# Altium schematic sheet Deej.SchDoc
size A4
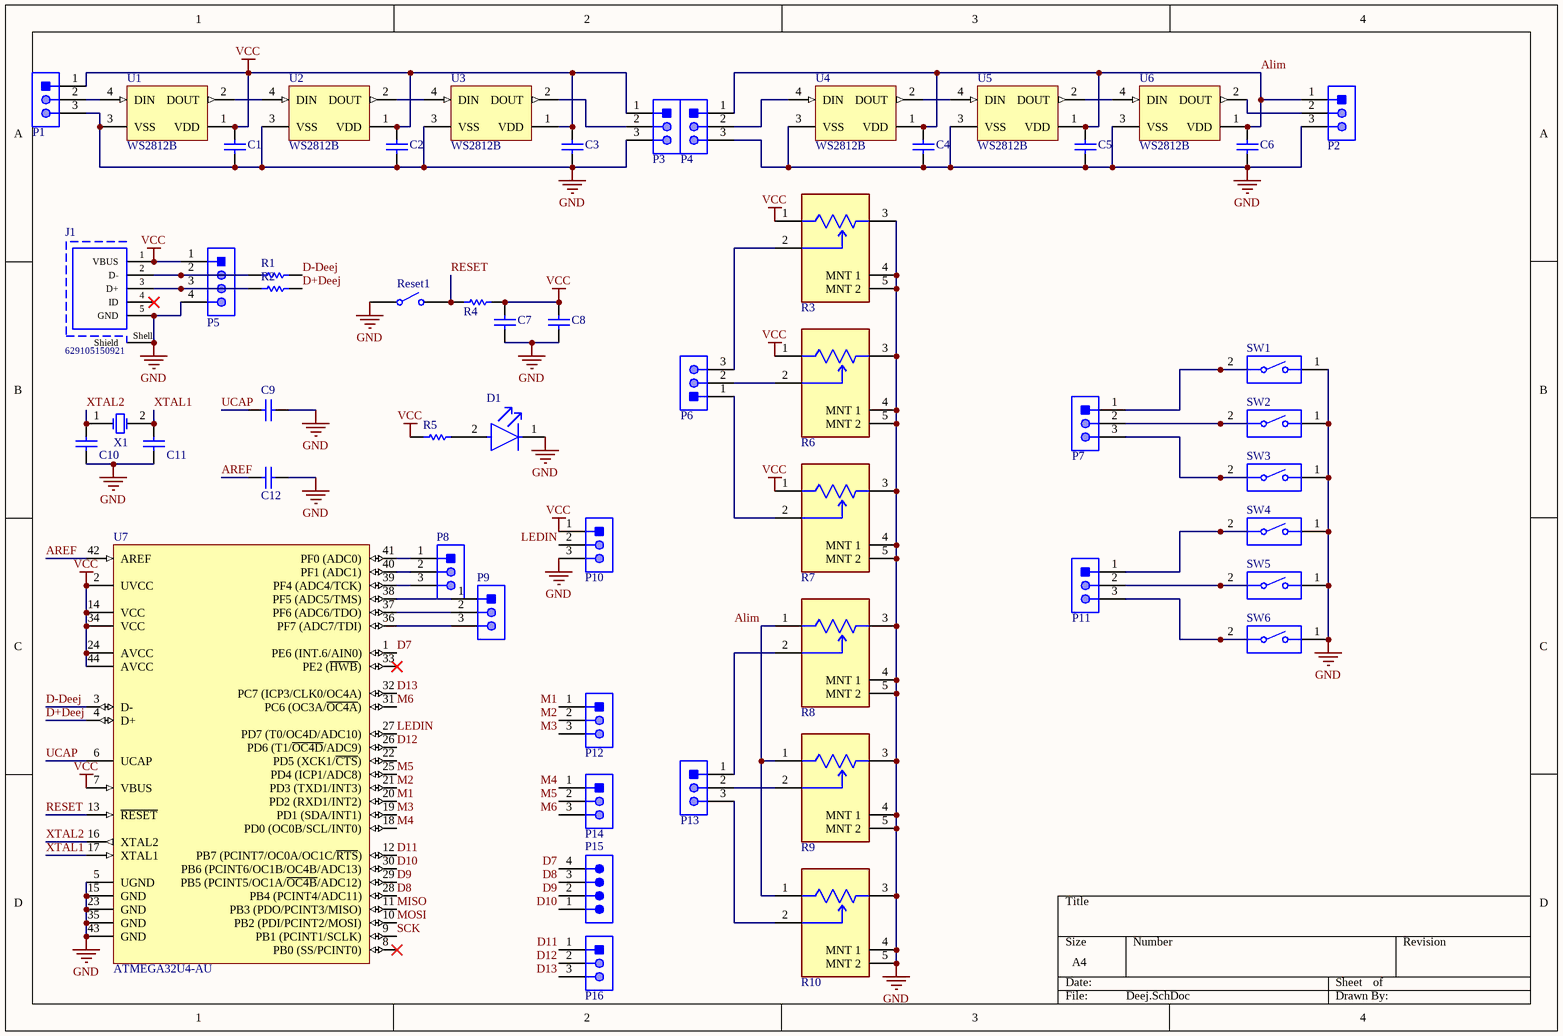
[diagram p0: Deej.SchDoc]

## Parts
C1  GRM31C5C1E104JA01L  [CAPC3216X180X55LL20T25]  (value not drawn)
C2  GRM31C5C1E104JA01L  [CAPC3216X180X55LL20T25]  (value not drawn)
C3  GRM31C5C1E104JA01L  [CAPC3216X180X55LL20T25]  (value not drawn)
C4  GRM31C5C1E104JA01L  [CAPC3216X180X55LL20T25]  (value not drawn)
C5  GRM31C5C1E104JA01L  [CAPC3216X180X55LL20T25]  (value not drawn)
C6  GRM31C5C1E104JA01L  [CAPC3216X180X55LL20T25]  (value not drawn)
C7  GRM31C5C1E104JA01L  [CAPC3216X180X55LL20T25]  (value not drawn)
C8  GRM31C5C1E104JA01L  [CAPC3216X180X55LL20T25]  (value not drawn)
C9  C1206C105K3RACTU  [CAPC3216X180X50ML20T25]  (value not drawn)
C10  CAP 22pF 50V 1206(3216)  [CAPC1206(3216)100_N]  (value not drawn)
C11  CAP 22 pF 50V 1206(3216)  [CAPC1206(3216)100_N]  (value not drawn)
C12  GRM31C5C1E104JA01L  [CAPC3216X180X55LL20T25]  (value not drawn)
D1  APTD3216CGCK  [FP-APTD3216CGCK-MFG]  (value not drawn)
J1  629105150921  [629105150921]
P1  22-28-4033  [MOLX-22-28-4033_V]  (value not drawn)
P2  22-28-4033  [MOLX-22-28-4033_V]  (value not drawn)
P3  22-28-4033  [MOLX-22-28-4033_V]  (value not drawn)
P4  22-28-4033  [MOLX-22-28-4033_V]  (value not drawn)
P5  61300411121  [61300411121]  (value not drawn)
P6  22-28-4033  [MOLX-22-28-4033_V]  (value not drawn)
P7  22-28-4033  [MOLX-22-28-4033_V]  (value not drawn)
P8  22-28-4033  [MOLX-22-28-4033_V]  (value not drawn)
P9  22-28-4033  [MOLX-22-28-4033_V]  (value not drawn)
P10  22-28-4033  [MOLX-22-28-4033_V]  (value not drawn)
P11  22-28-4033  [MOLX-22-28-4033_V]  (value not drawn)
P12  22-28-4033  [MOLX-22-28-4033_V]  (value not drawn)
P13  22-28-4033  [MOLX-22-28-4033_V]  (value not drawn)
P14  22-28-4033  [MOLX-22-28-4033_V]  (value not drawn)
P15  TSW-104-08-T-S  [SMTC-TSW-104-08-X-S]  (value not drawn)
P16  22-28-4033  [MOLX-22-28-4033_V]  (value not drawn)
R1  ERJ-8GEYJ220V  [RESC3216X70X50NL05T20]  (value not drawn)
R2  ERJ-8GEYJ220V  [RESC3216X70X50NL05T20]  (value not drawn)
R3  PTV09A-4020U-B103  [FP-PTV09A-4-MFG]  (value not drawn)
R4  ERJ-P08J103V  [RESC3216X70X50LL05T20]  (value not drawn)
R5  ERJ8ENF2203V  [RESC3216X70X50LL05T20]  (value not drawn)
R6  PTV09A-4020U-B103  [FP-PTV09A-4-MFG]  (value not drawn)
R7  PTV09A-4020U-B103  [FP-PTV09A-4-MFG]  (value not drawn)
R8  PTV09A-4020U-B103  [FP-PTV09A-4-MFG]  (value not drawn)
R9  PTV09A-4020U-B103  [FP-PTV09A-4-MFG]  (value not drawn)
R10  PTV09A-4020U-B103  [FP-PTV09A-4-MFG]  (value not drawn)
Reset1  434121025816  [434121025816]  (value not drawn)
SW1  MX1A-11NW  [CHRY-MX1A-11NW_V]  (value not drawn)
SW2  MX1A-11NW  [CHRY-MX1A-11NW_V]  (value not drawn)
SW3  MX1A-11NW  [CHRY-MX1A-11NW_V]  (value not drawn)
SW4  MX1A-11NW  [CHRY-MX1A-11NW_V]  (value not drawn)
SW5  MX1A-11NW  [CHRY-MX1A-11NW_V]  (value not drawn)
SW6  MX1A-11NW  [CHRY-MX1A-11NW_V]  (value not drawn)
U1  WS2812B  [ADAI-WS2812B_V]
U2  WS2812B  [ADAI-WS2812B_V]
U3  WS2812B  [ADAI-WS2812B_V]
U4  WS2812B  [ADAI-WS2812B_V]
U5  WS2812B  [ADAI-WS2812B_V]
U6  WS2812B  [ADAI-WS2812B_V]
U7  ATMEGA32U4-AU  [ATML-44ML_M]
X1  9C-3.6864MBBK-T  [TXC-9C-2_V]  (value not drawn)

## Nets
GND: C1.1 C2.1 C3.1 C4.1 C5.1 C6.1 C7.1 C8.1 C9.2 C10.1 C11.1 C12.1 D1.1(C) J1.5(GND) J1.Shell(Shield) P1.3 P2.3 P3.3 P4.3 P5.4 P10.3 R3.3 R3.4(MNT_1) R3.5(MNT_2) R6.3 R6.4(MNT_1) R6.5(MNT_2) R7.3 R7.4(MNT_1) R7.5(MNT_2) R8.3 R8.4(MNT_1) R8.5(MNT_2) R9.3 R9.4(MNT_1) R9.5(MNT_2) R10.3 R10.4(MNT_1) R10.5(MNT_2) Reset1.1 SW1.1 SW2.1 SW3.1 SW4.1 SW5.1 SW6.1 U1.3(VSS) U2.3(VSS) U3.3(VSS) U4.3(VSS) U5.3(VSS) U6.3(VSS) U7.5(UGND) U7.15(GND) U7.23(GND) U7.35(GND) U7.43(GND)
VCC: C1.2 C2.2 C3.2 C7.2 C8.2 J1.1(VBUS) P1.1 P3.1 P5.1 P10.1 R3.1 R4.1 R5.1 R6.1 R7.1 U1.1(VDD) U2.1(VDD) U3.1(VDD) U7.2(UVCC) U7.7(VBUS) U7.14(VCC) U7.24(AVCC) U7.34(VCC) U7.44(AVCC)
Alim: C4.2 C5.2 C6.2 P2.1 P4.1 R8.1 R9.1 R10.1 U4.1(VDD) U5.1(VDD) U6.1(VDD)
AREF: C12.2 U7.42(AREF)
D7: P15.4 U7.1(PE6_(INT.6/AIN0))
D8: P15.3 U7.28(PB4_(PCINT4/ADC11))
D9: P15.2 U7.29(PB5_(PCINT5/OC1A/~{OC4B}/ADC12))
D10: P15.1 U7.30(PB6_(PCINT6/OC1B/OC4B/ADC13))
D11: P16.1 U7.12(PB7_(PCINT7/OC0A/OC1C/~{RTS}))
D12: P16.2 U7.26(PD6_(T1/~{OC4D}/ADC9))
D13: P16.3 U7.32(PC7_(ICP3/CLK0/OC4A))
D+Deej: R2.2 U7.4(D+)
D-Deej: R1.2 U7.3(D-)
LEDIN: P10.2 U7.27(PD7_(T0/OC4D/ADC10))
M1: P12.1 U7.20(PD2_(RXD1/INT2))
M2: P12.2 U7.21(PD3_(TXD1/INT3))
M3: P12.3 U7.19(PD1_(SDA/INT1))
M4: P14.1 U7.18(PD0_(OC0B/SCL/INT0))
M5: P14.2 U7.25(PD4_(ICP1/ADC8))
M6: P14.3 U7.31(PC6_(OC3A/~{OC4A}))
MISO: U7.11(PB3_(PDO/PCINT3/MISO))
MOSI: U7.10(PB2_(PDI/PCINT2/MOSI))
RESET: R4.2 Reset1.2 U7.13(~{RESET})
SCK: U7.9(PB1_(PCINT1/SCLK))
UCAP: C9.1 U7.6(UCAP)
XTAL1: C11.2 U7.17(XTAL1) X1.2(X2)
XTAL2: C10.2 U7.16(XTAL2) X1.1(X1)
NetD1_2: D1.2(A) R5.2
NetJ1_2: J1.2(D-) P5.2 R1.1
NetJ1_3: J1.3(D+) P5.3 R2.1
NetP1_2: P1.2 U1.4(DIN)
NetP2_2: P2.2 U6.2(DOUT)
NetP3_2: P3.2 U3.2(DOUT)
NetP4_2: P4.2 U4.4(DIN)
NetP6_1: P6.1 R7.2
NetP6_2: P6.2 R6.2
NetP6_3: P6.3 R3.2
NetP7_1: P7.1 SW1.2
NetP7_2: P7.2 SW2.2
NetP7_3: P7.3 SW3.2
NetP8_1: P8.1 U7.41(PF0_(ADC0))
NetP8_2: P8.2 U7.40(PF1_(ADC1))
NetP8_3: P8.3 U7.39(PF4_(ADC4/TCK))
NetP9_1: P9.1 U7.38(PF5_(ADC5/TMS))
NetP9_2: P9.2 U7.37(PF6_(ADC6/TDO))
NetP9_3: P9.3 U7.36(PF7_(ADC7/TDI))
NetP11_1: P11.1 SW4.2
NetP11_2: P11.2 SW5.2
NetP11_3: P11.3 SW6.2
NetP13_1: P13.1 R8.2
NetP13_2: P13.2 R9.2
NetP13_3: P13.3 R10.2
NetU1_2: U1.2(DOUT) U2.4(DIN)
NetU2_2: U2.2(DOUT) U3.4(DIN)
NetU4_2: U4.2(DOUT) U5.4(DIN)
NetU5_2: U5.2(DOUT) U6.4(DIN)

Not connected (* = marked no-connect by the designer): J1 4(ID)*; U7 8(PB0_(SS/PCINT0))* 22(PD5_(XCK1/~{CTS})) 33(PE2_(~{HWB}))*

## Library data of the parts
C1-C8 C12 = CMP-2000-06343-1: Chip Capacitor, 100 nF, +/- 5%, 25 V, -55 to 125 degC, 1206 (3216 Metric), RoHS, Tape and Reel; Manufacturer: Murata; External Width: 0.5mm; Voltage Rating V DC: 25V; Capacitor Case Style: 1206[3216Metric]; Insulation Resistance: 10000Mohm; Capacitor Terminals: SMD; Capacitance: 0.1µF; Temperature Coefficient: 0ppm/°C±30ppm/°C; External Length / Height: 1mm; Reel Quantity: 2000; Dielectric Characteristic: C0G/NP0; SVHC: NoSVHC(19-Dec-2012); No. of Pins: 2; Manufacturer URL: http://www.murata.com/; Mounting Technology: SurfaceMount; Operating Temperature Range: -55°Cto+125°C; Operating Temperature Max: 125°C; Package Description: 2-Pin Surface Mount Device, Body 3.2 x 1.6 mm; Operating Temperature Min: -55°C; Terminal Type: SurfaceMount(SMD,SMT); MSL: –; Tolerance +: 5%; Voltage Rating: 25V; Datasheet URL: https://datasheet.ciiva.com/3777/11308grm31c5c1e104ja0123-3777177.pdf; Datasheet Version: 09/2014; Package / Case: 1206; Capacitance Tolerance: ±5%; Package Reference: 1206; Lead Spacing: –; Tolerance -: 5%
C9 = CMP-2000-04991-1: Chip Capacitor, 1 uF, +/- 10%, 25 V, -55 to 125 degC, 1206 (3216 Metric), RoHS, Tape and Reel; Manufacturer: Kemet; Temperature Coefficient / Code: +/-15%; Capacitance: 1uF; Dielectric: X7R; Voltage Rating DC: 25V; Capacitance - nF: 1000nF; Class: Class1; Case Length: 3.2mm; Type: SMDMLCCX7R6.3-250VDCCommericalGrade; Case Width: 1.6mm; Product: GeneralTypeMLCCs; Datasheet URL: https://ciiva.com/datasheet-click-18194173?src=ciiva&sig=6daff8c4; Operating Temperature Range: -55Cto+125C; Series: C1206C; RoHS: Details; Product Category: MultilayerCeramicCapacitorsMLCC-SMD/SMT; Manufacturer URL: http://www.kemet.com/; Minimum Operating Temperature: -55C; Dimensions: 1.6mmWx3.2mmLx1.6mmH; Termination Style: SMD/SMT; Brand: Kemet; Packaging: Reel; Package / Case: 1206(3216metric); Case Code - mm: 3216; Datasheet Version: Jul-14; Factory Pack Quantity: 2000; Package Description: 2-Pin Surface Mount Device, Body 3.2 x 1.6 mm; Tolerance: 10%; Package Reference: 1206; Case Height: 1.6mm; Case Code - in: 1206; Maximum Operating Temperature: +125C; Voltage Rating: 25V
C10 C11 = CMP-1037-03764-1: CAP 22nF 50V ±5% 1206 (3216 Metric) Thickness 1mm SMD; Tolerance: Â±5%; Case-Metric: 3216; Case-EIA: 1206; Technology: SMT; Rated Voltage: 50 V; Max Thickness: 1 mm; Value: 22nF
D1 = CMP-2000-05792-2: LED GREEN CLEAR 2SMD; Forward Voltage: 2.1V; Forward Current: 20mA; Luminous Intensity: 300mcd; Number of LEDs: 1; Dominant Wavelength: 570nm; Viewing Angle: 50°; Lead Free: Lead Free; Lens Color: Clear; Mount: Surface Mount; Package Quantity: 2000; Height: 1.8mm; Number of Pins: 2; Test Current: 20mA; Case Code (Metric): 3216; Case/Package: 1206; Case Code (Imperial): 1206; Illumination Color: Green; Color: Green; Width: 1.6mm; Packaging: Tape and Reel; Min Operating Temperature: -40°C; Lens Style: Clear; Max Operating Temperature: 85°C; Length: 3.2mm
J1 = CMP-1502-03249-1: Micro USB 2.0 Type AB Receptacle WR-COM, Horizontal, SMT; Manufacturer: Wurth Elektronik; Rated Current: 1.8A; Contact Resistance: 30mOhm; Working Voltage: 30VAC; Publisher: WurthElektronik; Part Number: 629105150921; Operating Temperature: -40to85degC; Gender: Receptacle; Packaging: TapeandReel; Connector Type: MicroUSB2.0TypeAB; Datasheet URL: https://katalog.we-online.de/em/datasheet/629105150921.pdf; Mounting Technology: SMT; Orientation: Horizontal; Package Reference: 629105150921; Manufacturer URL: http://www.we-online.de
P1-P4 P6-P14 P16 = CMP-1676-00001-5: Male Header, Pitch 2.54 mm, 1 x 3 Position, Height 8.38 mm, Tail Length 3.18 mm, RoHS, Bulk; Manufacturer: Molex; Rows: 1; Voltage Rating: 250 V; Current Rating: 4 A; Min Operating Temperature: 0 degC; Lead Pitch: 0.1 inch; Packaging: Bulk; Contact Finish: Gold; RoHSCompliant: true; Contact Material: Brass; PackageReference: 22-28-4033; REACH SVHC: Unknown; PackageDescription: Male Header, Pitch 2.54 mm, 1 x 3 Position, Height 8.38 mm, Tail Length 3.18 mm; ComponentLink2URL: http://www.molex.com/pdm_docs/sd/022284033_sd.pdf; Height: 8.38 mm; Mounting Technology: Through Hole; ComponentLink1Description: Manufacturer URL; Length: 7.62 mm; Mount: Through Hole; DatasheetVersion: Rev. G, 01/2012; Max Operating Temperature: 75 degC; ComponentLink2Description: Datasheet; Colour: Black; Pins: 3; Contact Plating: Gold; Package Quantity: 1; ComponentLink1URL: http://www.molex.com/
P5 = CMP-1502-01064-1: THT Vertical Pin Header WR-PHD, Pitch 2.54 mm, Single Row, 4 pins; Manufacturer: Wurth Elektronik; Withstanding Voltage: 500VAC; Rated Current: 3A; Working Voltage: 250VAC; Pin Number: 4; Gender: Male; Contact Resistance: 20mOhm; Pitch: 2.54mm; Manufacturer URL: http://www.we-online.de; Operating Temperature: -40to105degC; Packaging: Bag; Mounting Technology: THT; Package Reference: 61300411121; Datasheet URL: https://katalog.we-online.de/em/datasheet/6130xx11121.pdf; Publisher: WurthElektronik; Part Number: 61300411121; Row Number: Single; Orientation: Vertical
P15 = CMP-1024-00356-1: 0.025" SQ Post Header, Through-hole, Vertical, -55 to 105 degC, 2.54 mm Pitch, 4-Pin, Male, RoHS; Manufacturer: Samtec; Pitch: 2.54 mm; PackageDescription: .025[0.64] SQ. Post Terminal Strip Assembly; ComponentLink2URL: http://www.samtec.com/documents/webfiles/pdf/TSW_TH.PDF; ComponentLink3URL: http://www.samtec.com/documents/webfiles/cpdf/TSW-XXX-XX-XXX-X-XX-XXX-MKT.pdf; PackageVersion: DM, 8/1988; ComponentLink3Description: Package Specification; DatasheetVersion: F-214; Orientation: Vertical; RoHS: True; Mounting Technology: Through-hole; ComponentLink1URL: http://www.samtec.com; PartNumber: TSW-104-08-T-S; ComponentLink1Description: Manufacturer URL; Temperature Range: -55 to 105 degC; ComponentLink2Description: Datasheet; PackageReference: TSW-104-08-X-S
R1 R2 = CMP-2003-00585-1: Manufacturer: Panasonic; Part Number: ERJ-8GEYJ220V
R3 R6-R10 = CMP-07234-000013-1: POT 10K OHM 1/20W CARBON LINEAR; Manufacturer: Bourns Inc.; Voltage Rating: 50V; Resistance: 10kΩ; Tolerance: 20%; Value: 10kΩ; Power Rating: 0.05W; Composition: Carbon; Lead Free: Yes; Device Class L1: Passive Components; Device Class L3: Variable Resistors and Potentiometers; Temperature: -10°C to +50°C; Series: PTV09; Manufacturer Part Number: PTV09A-4020U-B103; Device Class L2: Resistors; Temperature Range Low: -10°C; Height: 20.5mm; Temperature Range High: +50°C; Octopart: https://octopart.com/ptv09a-4020u-b103-bourns-1878033; Digikey Description: POT 10K OHM 1/20W CARBON LINEAR; RoHS: TRUE; ComponentLink2URL: https://www.bourns.com/docs/product-datasheets/ptv09.pdf?sfvrsn=5e1089f1_12; Package: PTV09A-4; Mouser Description: Potentiometers 10K LINEAR 20%; Category: Res; ComponentLink2Description: Datasheet; Automotive: No
R4 = CMP-2003-00715-1: Manufacturer: Panasonic; Part Number: ERJ-P08J103V
R5 = CMP-2003-00820-1: Manufacturer: Panasonic; Part Number: ERJ8ENF2203V
Reset1 = CMP-1459-00004-1: WS-TASV SMD Tact Switch 6.0X3.8 mm; Manufacturer: Wuerth Elektronik; NoPins: 02; PackageReference: 434121025816; ComponentLink2URL: http://katalog.we-online.de/em/datasheet/434121025816.pdf; PartNumber: 434121025816; ComponentLink2Description: Datasheet; ComponentLink1URL: http://www.we-online.com; ComponentLink1Description: Manufacturer URL
SW1-SW6 = CMP-2000-06786-1: Keylock Switch, 12 V, -10 to 70 degC, 2-Pin THD, RoHS, Bulk; Manufacturer: Cherry; Part No: MX1A11NW; Maximum DC Voltage Rating: 12V; COO: UK; Row Spacing: 6.35mm; Pole Throw Configuration: SPST; Total Travel: 4.06mm; Illumination Type: N/R; Actuator Style: Button; Operating Force: 0.58N; Electrical Life: 50000000Cycle; Minimum Insulation Resistance: 100MOhm; Body Orientation: Straight; Actuator Length: 3.6mm; Switch Configuration: N.O.; Maximum Current Rating: 0.01A; Maximum Contact Resistance: 200mOhm; Actuator Color: N/A; Terminal Type: PCPins; Operating Temperature: -10to70C; Number of Terminals: 2; Operating Speed: N/A; Maximum AC Voltage Rating: 12V; Housing Material: N/A; Datasheet URL: https://cdn.sparkfun.com/datasheets/Components/Switches/MX%20Series.pdf; Type: DesktopProfile; Terminal Pitch: 2.54mm; Package Reference: MX1A-11NW; ECCN: EAR99; Family: MX; Packaging: N/A; HTS: 8536509065; Actuator Material: N/A; Package Description: 2-Pin Through Hole Device, Body 15.6 x 15.6 mm; Dielectric Strength: N/A; Illumination Color: N/R; Manufacturer URL: http://cherryswitches.com/cn/; Dimension: 15.6x15.6x15.2mm; Mechanical Life: N/A; RoHS: Unknown; Contact Plating: N/A; Supplier: CherryElectrical; Contact Material: Silver/Gold; IP Rating: N/A; Mounting: ThroughHole; Datasheet Version: 09/2000; Maximum Power Rating: N/A; Mounting Technology: ThroughHole
U1-U6 = CMP-007-00035-1: Intelligent Control LED Integrated Light Source, 3.5 to 5.3 V, -25 to 80 degC, 4-Pin SMD, RoHS, Bulk; Manufacturer: Adafruit Industries; Mounting Technology: SM; Case/Package: WS2812B; Datasheet URL: https://cdn-shop.adafruit.com/datasheets/WS2812B.pdf; Manufacturer URL: https://www.adafruit.com/; Package Reference: WS2812B; Package Description: 4-Pin Surface Mount Device, Body 5 x 5 mm, Pitch 3.3 mm; RoHS Compliant: False; Datasheet Version: May-13
U7 = CMP-020-00016-2: 8-bit Microcontroller with 32 Kbytes of ISP Flash and USB Controller, 2.7 to 5.5 V, -40 to 85 degC, 44-Pin QFP, Tray; Manufacturer: Atmel; Package Version: Rev. J, 02/2014; Min Supply Voltage: 2.7V; PWM Channels: 8; Ethernet Channels: 0; I/Os: 26; Max Clock Frequency: 16MHz; Density: 32KB; ADC Channels: 12; Max Supply Voltage: 5.5V; Interface: USART; RAM Size: 2.5KB; Pins: 44; Package Description: 44-Pin Thin Profile Plastic Quad Flat Papckage, Body 10 x 10 mm, Pitch 0.8 mm; Case/Package: TQFP; Packaging: Tray; Package URL: http://www.atmel.com/images/atmel-7766-8-bit-avr-atmega16u4-32u4_summary.pdf; Package Reference: 44ML; Mounting Technology: SM; Datasheet Version: Rev. 7766IS, 07/2015; RoHS Compliant: True; Frequency: 16MHz; Max Operating Temperature: 85°C; Package Quantity: 800; Min Operating Temperature: -40°C; Manufacturer URL: http://www.atmel.com/; Datasheet URL: http://www.atmel.com/images/atmel-7766-8-bit-avr-atmega16u4-32u4_summary.pdf
X1 = CMP-0724-00001-1: 9C Series Quartz Crystal, 3.6864 MHz, +/-50 ppm, 20 pF, -40 to 85 degC, 2-Pin 11.4 x 4.8 x 4.1 mm SMD, RoHS, Tape and Reel; Manufacturer: TXC; Load Capacitance: 20 pF; Frequency Stability (over Temp.): +/-50 ppm (-20 to 70 degC); PackageVersion: Jun-10; PackageDescription: 2-Pin SMD, Body 11.4 x 4.8 mm, Height 4.1 mm; Packing: Tape and Reel; PackageReference: 9C-2; ComponentLink2URL: http://www.txccrystal.com/images/pdf/9c.pdf; ComponentLink3URL: http://www.txccrystal.com/images/pdf/9c.pdf; PartNumber: 9C-3.6864MBBK-T; Mounting Technology: Surface Mount; ComponentLink3Description: Package Specification; ComponentLink2Description: Datasheet; Frequency Tolerance (at 25 degC): +/-50 ppm; ComponentLink1URL: http://www.txccrystal.com/; RoHS: TRUE; Frequency: 3.6864 MHz; DatasheetVersion: Jun-10; ComponentLink1Description: Manufacturer URL; Operating Temperature Range: -40 to 85 degC